# EAGLE design SprayController (EAGLE 6.5.0)
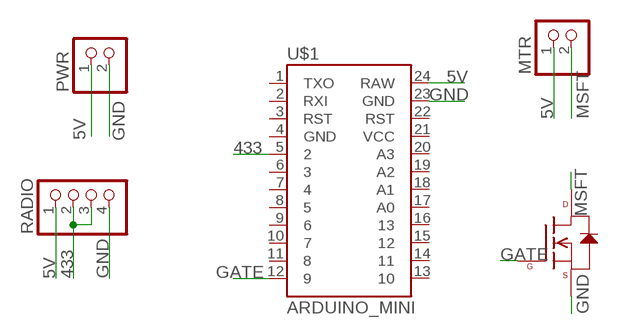
[diagram p0: schematic, sheet 1]

## Parts
MTR  PINHD-1X2/90  [1X02/90]
PWR  PINHD-1X2/90  [1X02/90]
Q1  N-CHANNEL-MOSFET-BSS138  [SOT23-3]
RADIO  PINHD-1X4/90  [1X04/90]
U$1  ARDUINO_MINI  [ARDUINO_MINI]

## Nets
5V: MTR.1 PWR.1 RADIO.1 U$1.24(RAW)
433: RADIO.2 RADIO.3 U$1.5
GATE: Q1.1(G) U$1.12
GND: PWR.2 Q1.2(S) RADIO.4 U$1.23(GND)
MSFT: MTR.2 Q1.3(D)
Unconnected: U$1.1(TXO) U$1.2(RXI) U$1.3(RST) U$1.4(GND) U$1.6 U$1.7 U$1.8 U$1.9 U$1.10 U$1.11 U$1.13 U$1.14 U$1.15 U$1.16 U$1.17(A0) U$1.18(A1) U$1.19(A2) U$1.20(A3) U$1.21(VCC) U$1.22(RST)

## Library data of the parts
MTR PWR = pinhead:PINHD-1X2: PIN HEADER
Q1 = GeekAmmo:N-CHANNEL-MOSFET: N-Channel MOSFET Mode Field Effect Transistor; DATASHEET: http://www.fairchildsemi.com/ds/BS/BSS138.pdf; DIGIKEY: BSS138TR-ND; ELEMENT14: 2323154; URL: http://au.element14.com/fairchild-semiconductor/bss138/mosfet-n-ch-50v-220ma-sot-23/dp/2323154
RADIO = pinhead:PINHD-1X4: PIN HEADER
U$1 = SparkFun-Boards:ARDUINO_MINI: Arduino Pro Mini footprint

## Board
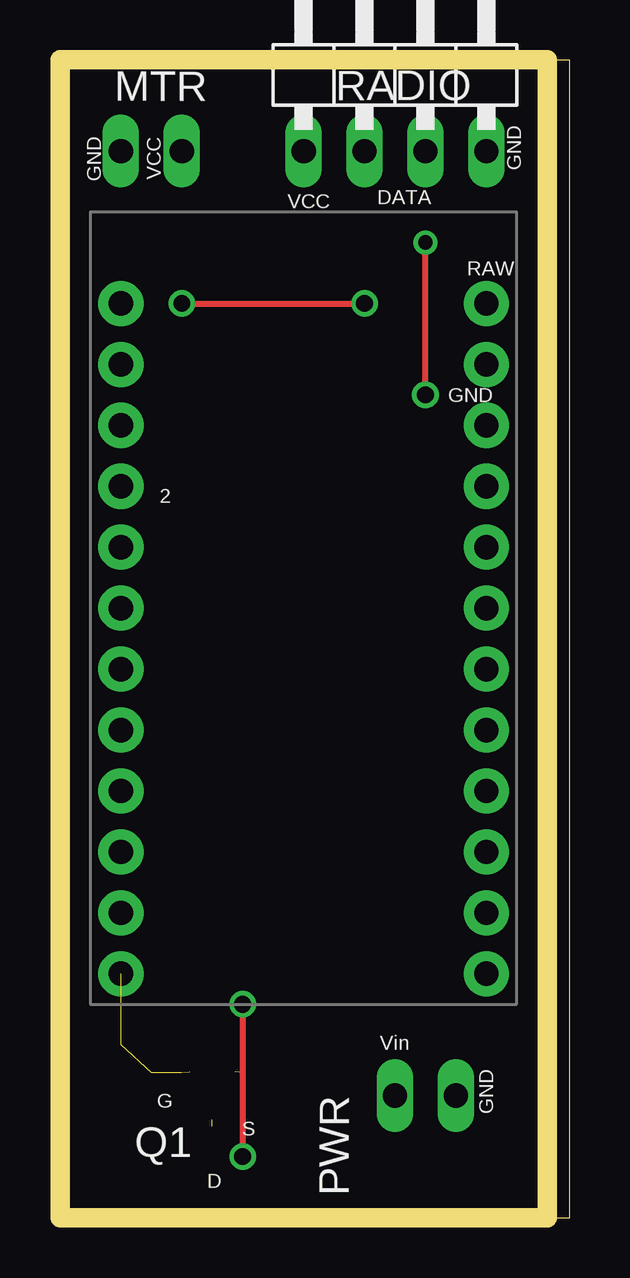
[diagram p1: board, top side]
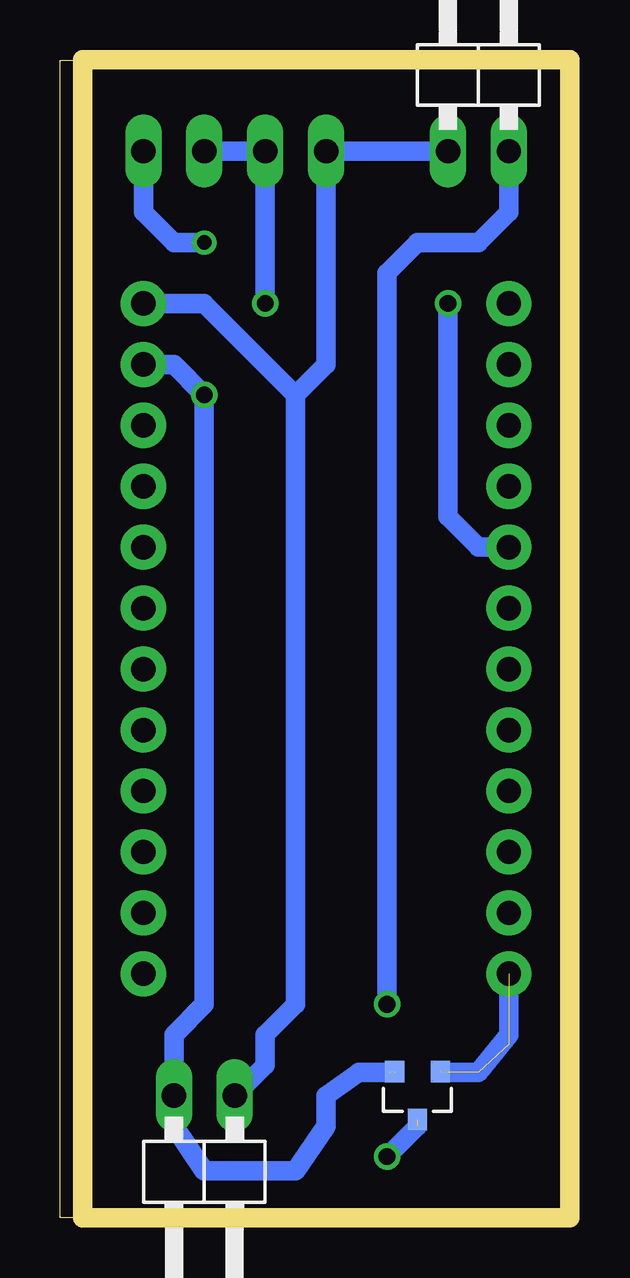
[diagram p2: board, bottom side, seen from below]

Size 21.26 x 48.25 mm. Coordinates in mm from the lower left corner, seen from the top.
Outline: 0,0 21.26,0 21.26,48.25 0,48.25 0,0
Copper layers (1*16): Top 0.035mm / dielectric 1.5mm / Bottom 0.035mm
Design rules "default": minimum track width 10mil, minimum drill 24mil, track to track 8mil, track to pad 8mil, pad to pad 8mil, via to via 8mil, smd to smd 8mil, copper to edge 40mil, drill to drill 8mil, minimum pad ring 10mil, minimum via ring 8mil, stop-mask expansion 4mil, vias tented up to drill 0mil, thermal gap 10mil
Milling: 4 lines

### Footprints (pad centres in the part's own frame; a part is rotated, then mirrored left to right if it is on the bottom)
1X02/90 = drill 1.016 long: 1 -1.27,-3.81; 2 1.27,-3.81
SOT23-3 = smd 0.8 x 0.9: 1 -0.95,-1; 2 0.95,-1; 3 0,1
1X04/90 = drill 1.016 long: 1 -3.81,-3.81; 2 -1.27,-3.81; 3 1.27,-3.81; 4 3.81,-3.81
ARDUINO_MINI = drill 1.016 pad 1.88: 1 -7.62,12.7; 2 -7.62,10.16; 3 -7.62,7.62; 4 -7.62,5.08; 5 -7.62,2.54; 6 -7.62,0; 7 -7.62,-2.54; 8 -7.62,-5.08; 9 -7.62,-7.62; 10 -7.62,-10.16; 11 -7.62,-12.7; 12 -7.62,-15.24; 13 7.62,-15.24; 14 7.62,-12.7; 15 7.62,-10.16; 16 7.62,-7.62; 17 7.62,-5.08; 18 7.62,-2.54; 19 7.62,0; 20 7.62,2.54; 21 7.62,5.08; 22 7.62,7.62; 23 7.62,10.16; 24 7.62,12.7

### Placement (x,y rotation side)
MTR  3.81,48.26 0 bottom
PWR  15.24,1.27 180 bottom
Q1  6.35,5.08 180 bottom
RADIO  13.97,48.26 0 top
U$1  10.16,25.4 0 top

### Tracks (layer width: path | path; a pad name or v marks a point on that pad's centre or on a via)
5V
  Bottom 0.813: U$1.24 15.24,38.1 11.43,34.29 | 11.43,34.29 11.43,8.89 12.7,7.62 12.7,6.35 PWR.1 | MTR.1 RADIO.1 10.16,35.56 11.43,34.29
433  (via drill 0.7 pad 0.81)
  Top 0.254: v5.08,38.1 v12.7,38.1
  Bottom 0.813: RADIO.3 RADIO.2 v12.7,38.1 | v5.08,38.1 5.08,29.21 3.81,27.94 U$1.5
GATE  (4 unrouted)
  Bottom 0.813: U$1.12 2.54,7.62 3.81,6.05 5.08,6.05
GND  (via drill 0.6 pad 0.81, 0.7 pad 0.81)  (1 unrouted)
  Top 0.254: v15.24,34.29 v15.24,40.64
  Bottom 0.813: RADIO.4 17.78,41.91 16.51,40.64 v15.24,40.64 | U$1.23 16.51,35.56 v15.24,34.29 15.24,8.89 16.51,7.62 PWR.2 16.51,3.81 15.24,1.94 11.43,1.94 10.16,3.81 10.16,5.08 8.79,6.05 7.52,6.05
MSFT  (via drill 0.7 pad 0.81)  (1 unrouted)
  Top 0.254: v7.62,8.89 v7.62,2.54
  Bottom 0.813: v7.62,8.89 7.62,39.37 6.35,40.64 3.81,40.64 2.54,41.91 MTR.2 | v7.62,2.54 6.35,3.81

### Text on the board
tNames: GND | GND | VCC | VCC | DATA | RAW | GND | 2 | Vin | G | GND | S | D